# Altium project Stabilizer_Pounder.PrjPCB (part 1 of 5)
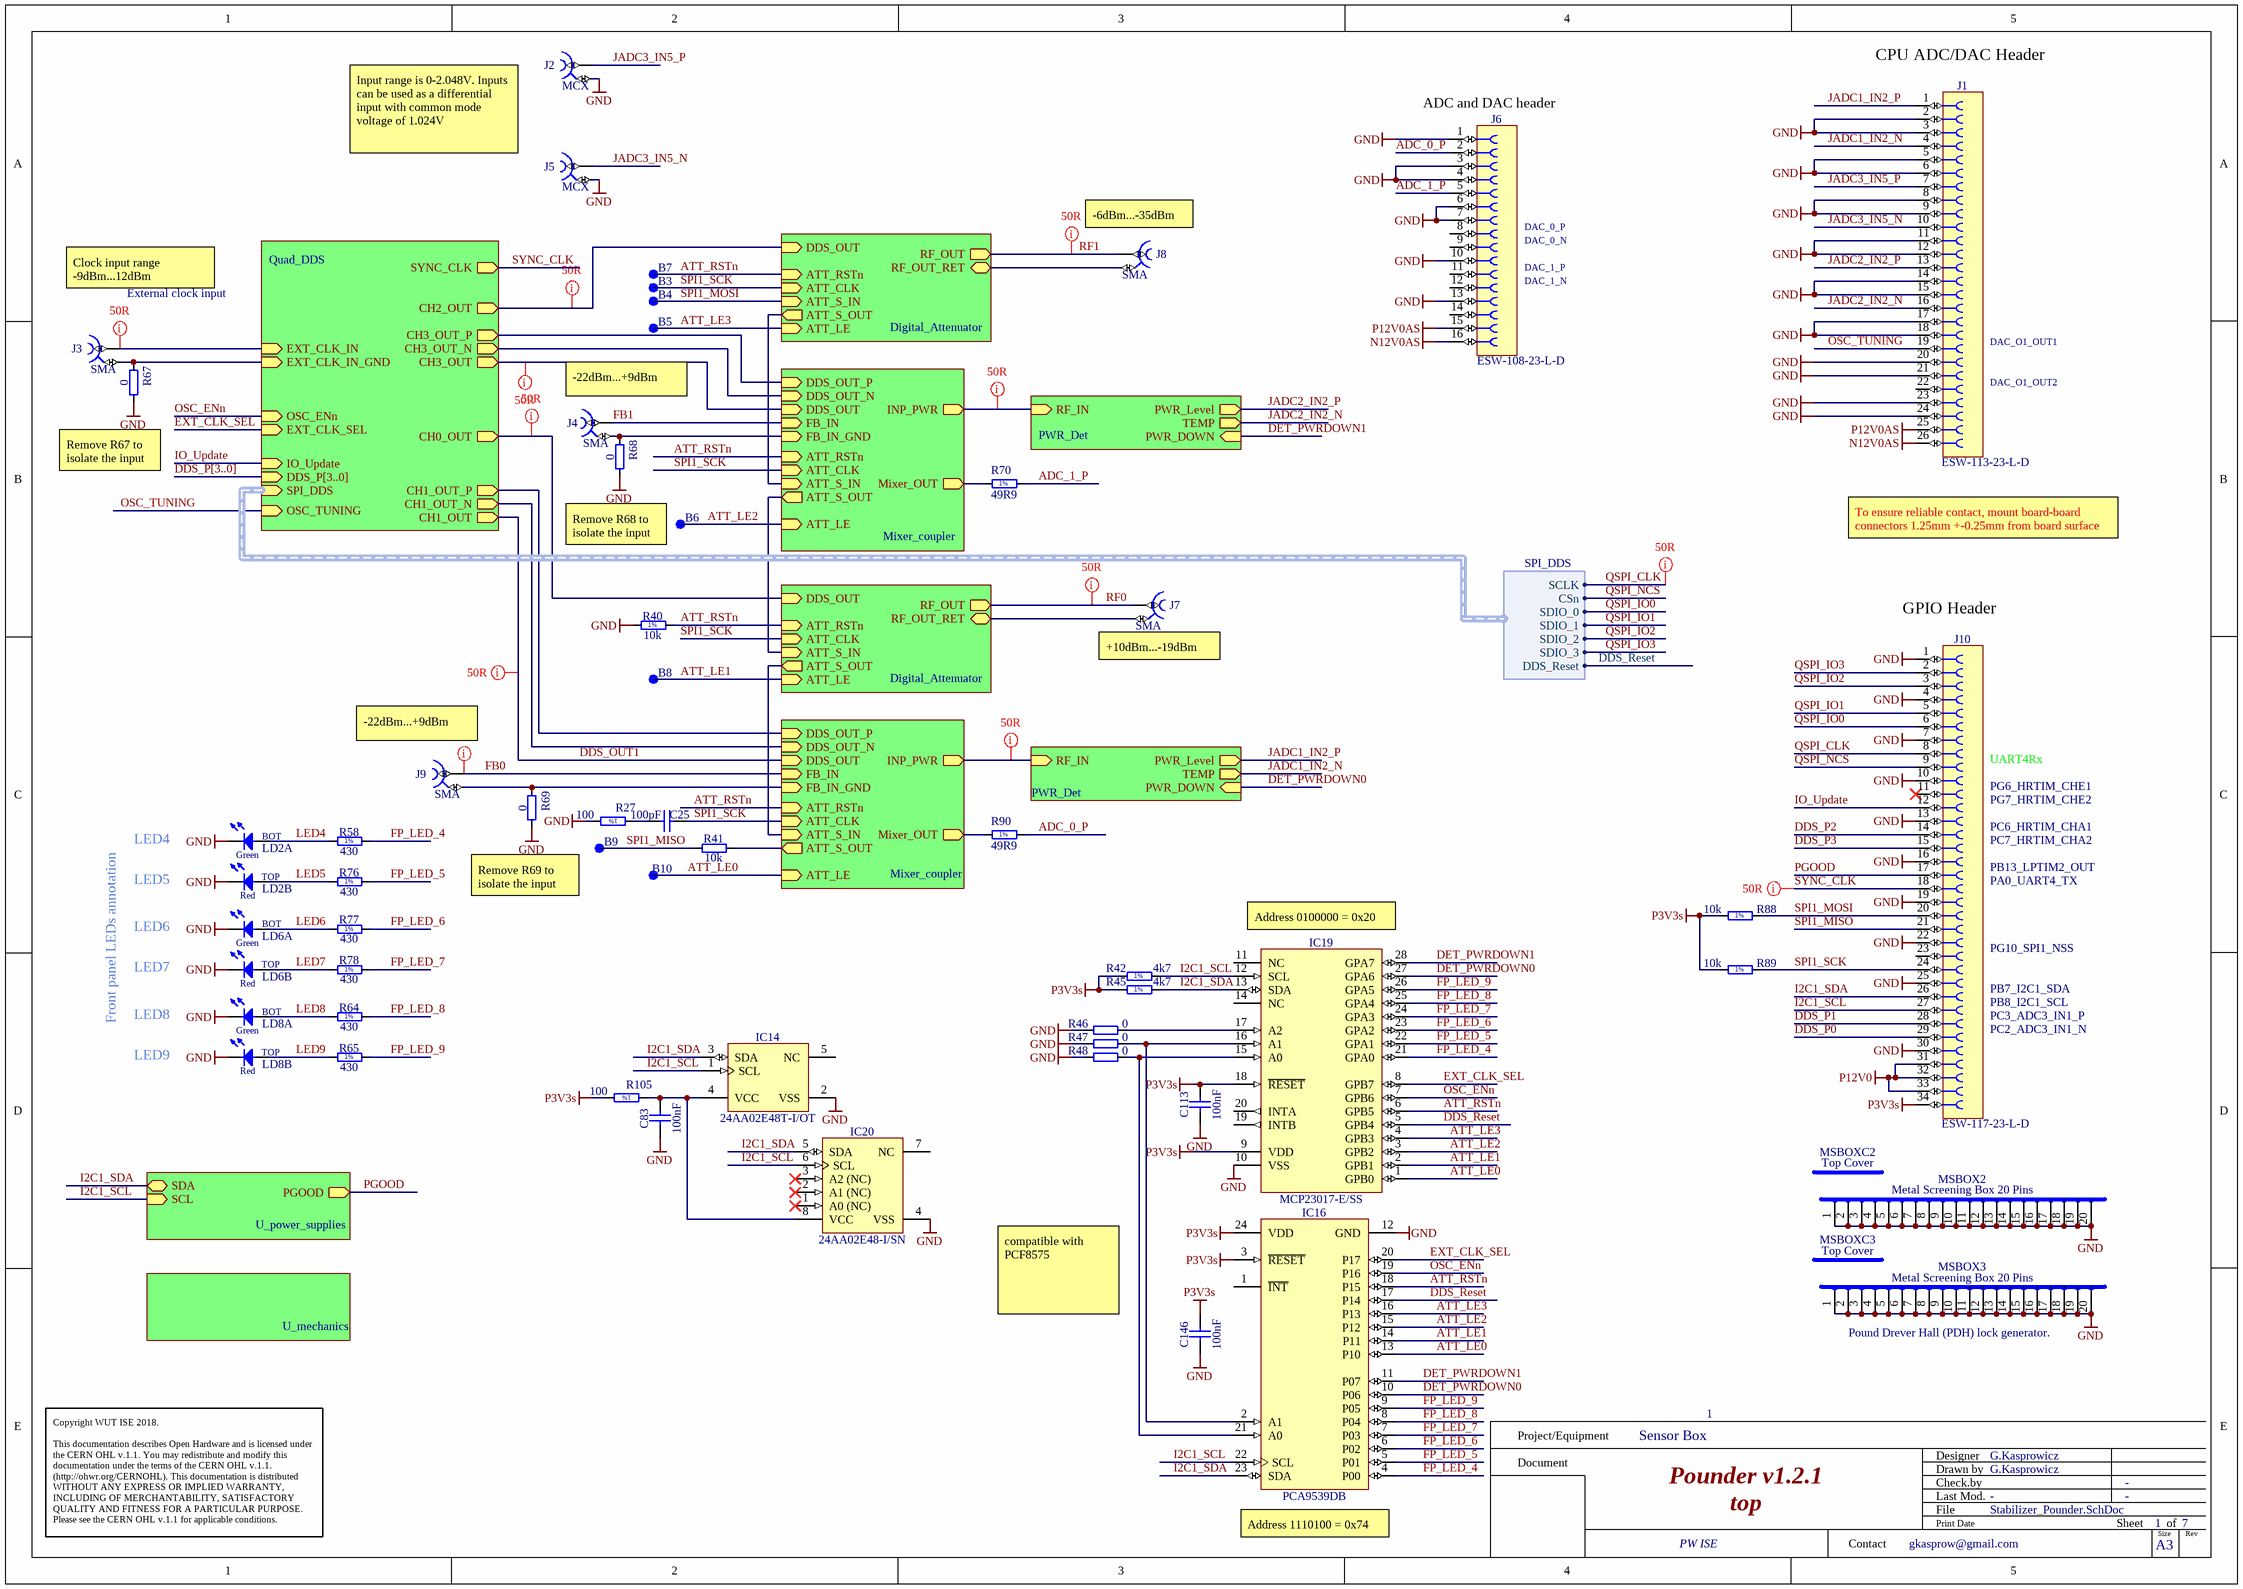
[diagram p0: Stabilizer_Pounder.SchDoc]
P_version: 1.2.1; ProjAddress1: WUT; ProjAddress3: PL; ProjOrganization: ISE; ProjRevision: 1.0
7 sheets, 591 parts. Net scope: hierarchical (ports join the sheet entries above them; power ports are global).
Board files: Stabilizer_Pounder.PcbDoc, Panel_Pounder.PcbDoc
Sheets:
  Stabilizer_Pounder.SchDoc
    U_power_supplies = power_supplies.SchDoc
    U_mechanics = mechanics.SchDoc
    Quad_DDS = Quad_DDS.SchDoc
    Digital_Attenuator = Digital_Attenuator.SchDoc
    PWR_Det = PWR_Det.SchDoc
    Mixer_coupler = Mixer_coupler.SchDoc
    Digital_Attenuator = Digital_Attenuator.SchDoc
    PWR_Det = PWR_Det.SchDoc
    Mixer_coupler = Mixer_coupler.SchDoc

## Sheet Stabilizer_Pounder.SchDoc: Pounder v1.2.1
size 420 x 297 mm; Author: G.Kasprowicz; CompanyName: WUT ISE; DrawnBy: G.Kasprowicz; Organization: WUT ISE; Address1: PW ISE; Address2: Nowowiejska 15/19 00-665 Warsaw; Address3: gkasprow@gmail.com; DocumentNumber: 1; Revision: 1.2.1; SheetNumber: 1; SheetTotal: 7; ModifiedBy: -; CheckedDate: -; Title2: top; DivGrp: WUT ISE; Designer: G.Kasprowicz; ModifiedDate: -; ProjectName: Sensor Box

### Parts
B3  SMD Pad  [C100]  (value not drawn)
B4  SMD Pad  [C100]  (value not drawn)
B5  SMD Pad  [C100]  (value not drawn)
B6  SMD Pad  [C100]  (value not drawn)
B7  SMD Pad  [C100]  (value not drawn)
B8  SMD Pad  [C100]  (value not drawn)
B9  SMD Pad  [C100]  (value not drawn)
B10  SMD Pad  [C100]  (value not drawn)
C25  100pF  [CAPC1005X55N]
C83  100nF  [CAPC1005X55N]
C113  100nF  [CAPC1005X55N]
C146  100nF  [CAPC1005X55N]
IC14  24AA02E48T-I/OT  [SOT95P280X145-5N]
IC16  PCA9539DB  [SOP65P780X200-24N]
IC19  MCP23017-E/SS  [SOP65P780X200-28N]
IC20  24AA02E48-I/SN  [SOIC127P600X175-8N]
J1  ESW-113-23-L-D  [ESW-113-23-L-D]
J2  MCX  [AMPHENOL_919-383J-51A]
J3  SMA  [DELOCK_65848]
J4  SMA  [DELOCK_65848]
J5  MCX  [AMPHENOL_919-383J-51A]
J6  ESW-108-23-L-D  [ESW-108-23-L-D]
J7  SMA  [DELOCK_65848]
J8  SMA  [DELOCK_65848]
J9  SMA  [DELOCK_65848]
J10  ESW-117-23-L-D  [ESW-117-23-L-D]
LD2  Red/Green  [LED_DIALIGHT_571-0112F]  (value not drawn)  (parts A,B of 2)
LD6  Red/Green  [LED_DIALIGHT_571-0112F]  (value not drawn)  (parts A,B of 2)
LD8  Red/Green  [LED_DIALIGHT_571-0112F]  (value not drawn)  (parts A,B of 2)
MSBOX2  Metal Screening Box 20 Pins  [MSBOX_LAIRD_BMI-S-205-F]
MSBOX3  Metal Screening Box 20 Pins  [MSBOX_LAIRD_BMI-S-205-F]
MSBOXC2  Top Cover  [MSBOX_LAIRD_BMI-S-205-C]
MSBOXC3  Top Cover  [MSBOX_LAIRD_BMI-S-205-C]
R27  100  [RESC1005X40N]
R40  10k  [RESC1005X40N]
R41  10k  [RESC1005X40N]
R42  4k7  [RESC1005X40N]
R45  4k7  [RESC1005X40N]
R46  0  [RESC1005X40N]
R47  0  [RESC1005X40N]
R48  0  [RESC1005X40N]
R58  430  [RESC1608X55N]
R64  430  [RESC1608X55N]
R65  430  [RESC1608X55N]
R67  0  [RESC1608X55N]
R68  0  [RESC1608X55N]
R69  0  [RESC1608X55N]
R70  49R9  [RESC1608X55N]
R76  430  [RESC1608X55N]
R77  430  [RESC1608X55N]
R78  430  [RESC1608X55N]
R88  10k  [RESC1005X40N]
R89  10k  [RESC1005X40N]
R90  49R9  [RESC1608X55N]
R105  100  [RESC1005X40N]

### Sub-sheets
Digital_Attenuator = Digital_Attenuator.SchDoc: RF_OUT (out), ATT_RSTn (in), ATT_CLK (in), ATT_S_OUT (out), ATT_S_IN (in), ATT_LE (in), DDS_OUT (in), RF_OUT_RET (bidir)
Digital_Attenuator = Digital_Attenuator.SchDoc: RF_OUT (out), ATT_RSTn (in), ATT_CLK (in), ATT_S_OUT (out), ATT_S_IN (in), ATT_LE (in), DDS_OUT (in), RF_OUT_RET (bidir)
Mixer_coupler = Mixer_coupler.SchDoc: INP_PWR (out), FB_IN (in), FB_IN_GND (in), DDS_OUT (in), Mixer_OUT (out), ATT_S_OUT (out), ATT_CLK (in), ATT_RSTn (in), ATT_S_IN (in), ATT_LE (in), DDS_OUT_P (in), DDS_OUT_N (in)
Mixer_coupler = Mixer_coupler.SchDoc: INP_PWR (out), FB_IN (in), FB_IN_GND (in), DDS_OUT (in), Mixer_OUT (out), ATT_S_OUT (out), ATT_CLK (in), ATT_LE (in), ATT_RSTn (in), ATT_S_IN (in), DDS_OUT_P (in), DDS_OUT_N (in)
PWR_Det = PWR_Det.SchDoc: RF_IN (in), PWR_Level (out), TEMP (out), PWR_DOWN (in)
PWR_Det = PWR_Det.SchDoc: RF_IN (in), PWR_Level (out), TEMP (out), PWR_DOWN (in)
Quad_DDS = Quad_DDS.SchDoc: CH3_OUT (out), CH1_OUT (out), OSC_ENn (in), CH0_OUT (out), EXT_CLK_SEL (in), EXT_CLK_IN (in), CH2_OUT (out), EXT_CLK_IN_GND (in), IO_Update (in), DDS_P[3..0] (in), SPI_DDS (in, harness SPI_DDS), OSC_TUNING (in), SYNC_CLK (out), CH1_OUT_P (out), CH3_OUT_N (out), CH3_OUT_P (out), CH1_OUT_N (out)
U_mechanics = mechanics.SchDoc: no entries
U_power_supplies = power_supplies.SchDoc: SDA (bidir), SCL (in), PGOOD (out)

### Harnesses
SPI_DDS: SCLK, CSn, SDIO_0, SDIO_1, SDIO_2, SDIO_3, DDS_Reset

### Nets
GND: C83.1 C113.1 C146.1 IC14.2(VSS) IC16.12(GND) IC19.10(VSS) IC20.4(VSS) J1.2 J1.3 J1.5 J1.6 J1.8 J1.9 J1.11 J1.12 J1.14 J1.15 J1.17 J1.18 J1.20 J1.21 J1.23 J1.24 J2.2 J5.2 J6.1 J6.3 J6.4 J6.6 J6.7 J6.10 J6.13 J10.1 J10.4 J10.7 J10.10 J10.13 J10.16 J10.19 J10.22 J10.25 J10.30 LD2.1(C) LD2.3(C) LD6.1(C) LD6.3(C) LD8.1(C) LD8.3(C) MSBOX2.1 MSBOX2.2 MSBOX2.3 MSBOX2.4 MSBOX2.5 MSBOX2.6 MSBOX2.7 MSBOX2.8 MSBOX2.9 MSBOX2.10 MSBOX2.11 MSBOX2.12 MSBOX2.13 MSBOX2.14 MSBOX2.15 MSBOX2.16 MSBOX2.17 MSBOX2.18 MSBOX2.19 MSBOX2.20 MSBOX3.1 MSBOX3.2 MSBOX3.3 MSBOX3.4 MSBOX3.5 MSBOX3.6 MSBOX3.7 MSBOX3.8 MSBOX3.9 MSBOX3.10 MSBOX3.11 MSBOX3.12 MSBOX3.13 MSBOX3.14 MSBOX3.15 MSBOX3.16 MSBOX3.17 MSBOX3.18 MSBOX3.19 MSBOX3.20 R27.2 R40.1 R46.1 R47.1 R48.1 R67.2 R68.2 R69.2
N12V0AS: J1.26 J6.16
P3V3s: C113.2 C146.2 IC16.3(~{RESET}) IC16.24(VDD) IC19.9(VDD) IC19.18(~{RESET}) J10.34 R42.1 R45.1 R88.1 R89.1 R105.2
P12V0: J10.31 J10.32 J10.33
P12V0AS: J1.25 J6.15
ADC_0_P: J6.2 R90.2
ADC_1_P: J6.5 R70.2
ATT_LE0: B10.1 IC16.13(P10) IC19.1(GPB0) ; sheet Mixer_coupler/ATT_LE  [project net ATT_LE]
ATT_LE1: B8.1 IC16.14(P11) IC19.2(GPB1) ; sheet Digital_Attenuator/ATT_LE
ATT_LE2: B6.1 IC16.15(P12) IC19.3(GPB2) ; sheet Mixer_coupler/ATT_LE  [project net ATT_LE]
ATT_LE3: B5.1 IC16.16(P13) IC19.4(GPB3) ; sheet Digital_Attenuator/ATT_LE
ATT_RSTn: B7.1 IC16.18(P15) IC19.6(GPB5) R40.2 ; sheet Digital_Attenuator/ATT_RSTn, sheet Mixer_coupler/ATT_RSTn, sheet Digital_Attenuator/ATT_RSTn, sheet Mixer_coupler/ATT_RSTn
CH1_OUTC_N: sheet Quad_DDS/CH1_OUT_N, sheet Mixer_coupler/DDS_OUT_N
CH1_OUTC_P: sheet Quad_DDS/CH1_OUT_P, sheet Mixer_coupler/DDS_OUT_P
CH3_OUTC_N: sheet Quad_DDS/CH3_OUT_N, sheet Mixer_coupler/DDS_OUT_N
CH3_OUTC_P: sheet Quad_DDS/CH3_OUT_P, sheet Mixer_coupler/DDS_OUT_P
DDS_OUT1: sheet Quad_DDS/CH1_OUT, sheet Mixer_coupler/DDS_OUT
DDS_P0: J10.29
DDS_P1: J10.28
DDS_P2: J10.14
DDS_P3: J10.15
DDS_Reset: IC16.17(P14) IC19.5(GPB4) ; sheet Quad_DDS/SPI_DDS.DDS_Reset
DET_PWRDOWN0: IC16.10(P06) IC19.27(GPA6) ; sheet PWR_Det/PWR_DOWN
DET_PWRDOWN1: IC16.11(P07) IC19.28(GPA7) ; sheet PWR_Det/PWR_DOWN
EXT_CLK_SEL: IC16.20(P17) IC19.8(GPB7) ; sheet Quad_DDS/EXT_CLK_SEL
FB0: J9.1 ; sheet Mixer_coupler/FB_IN
FB1: J4.1 ; sheet Mixer_coupler/FB_IN
FP_LED_4: IC16.4(P00) IC19.21(GPA0) R58.2
FP_LED_5: IC16.5(P01) IC19.22(GPA1) R76.2
FP_LED_6: IC16.6(P02) IC19.23(GPA2) R77.2
FP_LED_7: IC16.7(P03) IC19.24(GPA3) R78.2
FP_LED_8: IC16.8(P04) IC19.25(GPA4) R64.2
FP_LED_9: IC16.9(P05) IC19.26(GPA5) R65.2
I2C1_SCL: IC14.1(SCL) IC16.22(SCL) IC19.12(SCL) IC20.6(SCL) J10.27 R42.2 ; sheet U_power_supplies/SCL
I2C1_SDA: IC14.3(SDA) IC16.23(SDA) IC19.13(SDA) IC20.5(SDA) J10.26 R45.2 ; sheet U_power_supplies/SDA
IO_Update: J10.12 ; sheet Quad_DDS/IO_Update
JADC1_IN2_N: J1.4 ; sheet PWR_Det/TEMP
JADC1_IN2_P: J1.1 ; sheet PWR_Det/PWR_Level
JADC2_IN2_N: J1.16 ; sheet PWR_Det/TEMP
JADC2_IN2_P: J1.13 ; sheet PWR_Det/PWR_Level
JADC3_IN5_N: J1.10 J5.1
JADC3_IN5_P: J1.7 J2.1
LED4: LD2.2(A) R58.1
LED5: LD2.4(A) R76.1
LED6: LD6.2(A) R77.1
LED7: LD6.4(A) R78.1
LED8: LD8.2(A) R64.1
LED9: LD8.4(A) R65.1
OSC_ENn: IC16.19(P16) IC19.7(GPB6) ; sheet Quad_DDS/OSC_ENn
OSC_TUNING: J1.19 ; sheet Quad_DDS/OSC_TUNING
PGOOD: J10.17 ; sheet U_power_supplies/PGOOD
QSPI_CLK: J10.8 ; sheet Quad_DDS/SPI_DDS.SCLK
QSPI_IO0: J10.6 ; sheet Quad_DDS/SPI_DDS.SDIO_0
QSPI_IO1: J10.5 ; sheet Quad_DDS/SPI_DDS.SDIO_1
QSPI_IO2: J10.3 ; sheet Quad_DDS/SPI_DDS.SDIO_2
QSPI_IO3: J10.2 ; sheet Quad_DDS/SPI_DDS.SDIO_3
QSPI_NCS: J10.9 ; sheet Quad_DDS/SPI_DDS.CSn  [project net CSn]
RF0: J7.1 ; sheet Digital_Attenuator/RF_OUT
RF1: J8.1 ; sheet Digital_Attenuator/RF_OUT
SPI1_MISO: B9.1 J10.21 R41.1
SPI1_MOSI: B4.1 J10.20 R88.2 ; sheet Digital_Attenuator/ATT_S_IN
SPI1_SCK: B3.1 C25.2 J10.24 R89.2 ; sheet Digital_Attenuator/ATT_CLK, sheet Mixer_coupler/ATT_CLK, sheet Digital_Attenuator/ATT_CLK, sheet Mixer_coupler/ATT_CLK  [project net ATT_CLK]
SYNC_CLK: J10.18 ; sheet Quad_DDS/SYNC_CLK
NetC25_1: C25.1 R27.1
NetC26B_2: sheet Mixer_coupler/ATT_S_OUT, sheet Digital_Attenuator/ATT_S_IN
NetC83_2: C83.2 IC14.4(VCC) IC20.8(VCC) R105.1
NetC86A_2: sheet Digital_Attenuator/ATT_S_OUT, sheet Mixer_coupler/ATT_S_IN
NetC86B_2: sheet Digital_Attenuator/ATT_S_OUT, sheet Mixer_coupler/ATT_S_IN
NetC114A_1: sheet PWR_Det/RF_IN, sheet Mixer_coupler/INP_PWR
NetC114B_1: sheet PWR_Det/RF_IN, sheet Mixer_coupler/INP_PWR
NetC119A_2: R70.1 ; sheet Mixer_coupler/Mixer_OUT
NetC119B_2: R90.1 ; sheet Mixer_coupler/Mixer_OUT
NetFL2A_1: sheet Quad_DDS/CH2_OUT, sheet Digital_Attenuator/DDS_OUT
NetFL2B_1: sheet Quad_DDS/CH0_OUT, sheet Digital_Attenuator/DDS_OUT
NetFL3A_2: J4.2 R68.1 ; sheet Mixer_coupler/FB_IN_GND
NetFL3B_2: J9.2 R69.1 ; sheet Mixer_coupler/FB_IN_GND
NetFL4A_1: sheet Quad_DDS/CH3_OUT, sheet Mixer_coupler/DDS_OUT
NetIC8B_19: R41.2 ; sheet Mixer_coupler/ATT_S_OUT
NetIC16_2: IC16.2(A1) IC19.16(A1) R47.2
NetIC16_21: IC16.21(A0) IC19.15(A0) R48.2
NetIC19_17: IC19.17(A2) R46.2
NetJ3_1: J3.1 ; sheet Quad_DDS/EXT_CLK_IN
NetJ3_2: J3.2 R67.1 ; sheet Quad_DDS/EXT_CLK_IN_GND
NetJ7_2: J7.2 ; sheet Digital_Attenuator/RF_OUT_RET
NetJ8_2: J8.2 ; sheet Digital_Attenuator/RF_OUT_RET

Not connected (* = marked no-connect by the designer): IC14 5(NC); IC16 1(~{INT}); IC19 11(NC) 14(NC) 19(INTB) 20(INTA); IC20 1(A0_(NC))* 2(A1_(NC))* 3(A2_(NC))* 7(NC); J1 22; J6 8 9 11 12 14; J10 11* 23

### Buses and harness runs
bus DDS_P[3..0] = sheet Quad_DDS/DDS_P[3..0]

### Layout directives
net class Z50R: DDS_OUT1, FB0, NetC114A_1, NetC114B_1, NetFL2A_1, NetFL2B_1, NetFL4A_1, NetJ3_1, QSPI_CLK, RF0, RF1, SYNC_CLK

### Notes on the sheet
- (near J6) ADC and DAC header
- (near J1) CPU ADC/DAC Header
- Input range is 0-2.048V. Inputs can be used as a differential input with common mode voltage of 1.024V
- (near J8) -6dBm...-35dBm
- (near J6) DAC_0_P
- (near J6) DAC_0_N
- Clock input range
  -9dBm...12dBm
- External clock input
- (near J6) DAC_1_P
- (near J6) DAC_1_N
- -22dBm...+9dBm
- (near J1) DAC_O1_OUT1
- (near J1) DAC_O1_OUT2
- (near R67) Remove R67 to isolate the input
- To ensure reliable contact, mount board-board connectors 1.25mm +-0.25mm from board surface
- (near B6) Remove R68 to isolate the input
- (near J7) +10dBm...-19dBm
- (near J10) GPIO Header
- (near J9) -22dBm...+9dBm
- (near J10) UART4Rx
- (near J10) PG6_HRTIM_CHE1
- (near J10) PG7_HRTIM_CHE2
- LED4
- (near J10) PC6_HRTIM_CHA1
- (near J10) PC7_HRTIM_CHA2
- LED5
- LED6
- Remove R69 to isolate the input
- (near IC19) Address 0100000 = 0x20
- (near J10) PB13_LPTIM2_OUT
- (near J10) PA0_UART4_TX
- LED7
- (near J10) PB7_I2C1_SDA
- (near J10) PG10_SPI1_NSS
- Front panel LEDs annotation
- LED8
- LED9
- (near J10) PC3_ADC3_IN1_P
- (near J10) PC2_ADC3_IN1_N
- (near J10) PB8_I2C1_SCL
- compatible with
  PCF8575
- (near MSBOX3) Pound Drever Hall (PDH) lock generator.
- (near IC16) Address 1110100 = 0x74
- Project/Equipment
- Document
- Designer
- Drawn by
- Check.by
- Copyright WUT ISE 2018.
  This documentation describes Open Hardware and is licensed under the CERN OHL v.1.1. You may redistribute and modify this documentation under the terms of the CERN OHL v.1.1. (http://ohwr.org/CERNOHL). This documentation is distributed WITHOUT ANY EXPRESS OR IMPLIED WARRANTY, INCLUDING OF MERCHANTABILITY, SATISFACTORY QUALITY AND FITNESS FOR A PARTICULAR PURPOSE. Please see the CERN OHL v.1.1 for applicable conditions.
- Contact
- File
- Last Mod.
- Print Date
- Sheet
- Size
- A3
- of
- Rev
- (in symbol LED_DIALIGHT_571-0112F, part A) BOT; Green
- (in symbol LED_DIALIGHT_571-0112F, part B) TOP; Red
- (in symbol R0402_4K7_1%_0.0625W_100PPM) 1%
- (in symbol R0402_10k_1%_0.0625W_100PPM) 1%
- (in symbol R0402_10K_1%_0.0625W_100PPM) 1%
- (in symbol R0402_100R_1%_0.0625W_100PPM) 1%
- (in symbol R0603_49R9_1%_0.1W_100PPM) 1%
- (in symbol R0603_430R_1%_0.1W_100PPM) 1%

### Library data of the parts
B3-B10 = SMD_PAD_D1MM: Through Hole Pad; Part Description: 1mm Diameter SMD Pad; Mounted: No; Part Number: SMD_PAD_D1MM; Component Kind: Standard (No BOM); Component Type: Standard (No BOM); Pin Count: 1; Family: SMD Pad; Socket: No; SMD: No; Sense: No; Status: None; ComponentHeight: 0mm; HelpURL: Undefined; Author: CERN DEM JLC; CreateDate: 10.10.2017; LatestRevisionDate: 10.10.2017; PackageDescription: 1mm Diameter SMD Pad
C25 = CC0402_100PF_50V_5%_C0G: Non-polarised capacitor; Part Description: SMD Multilayer Chip Ceramic Capacitor; Manufacturer: GENERIC; Manufacturer1 Part Number: C0402C101J5GACTU; Voltage: 50V; TC: C0G/NP0; Tolerance: ±5%; Part Number: CC0402_100PF_50V_5%_C0G; Component Kind: Standard; Component Type: Standard; Pin Count: 2; Value: 100pF; Status: Preferred; Manufacturer Part Number: CC0402_100PF_50V_5%_C0G; Case: 0402; Mounted: Yes; Socket: No; SMD: Yes; Sense: No; Manufacturer1 Example: KEMET; Manufacturer1 ComponentHeight: 0.55mm; HelpURL: \\cern.ch\dfs\Applications\Altium\Datasheets\CC0805_C0G_KEMET_(Commercial Grade).pdf; Author: CERN DEM JLC; CreateDate: 03.12.2007; LatestRevisionDate: 22.04.2015
C83 C113 C146 = CC0402_100NF_16V_10%_X5R: Non-polarised capacitor; Part Description: SMD Multilayer Chip Ceramic Capacitor; Manufacturer: GENERIC; Manufacturer1 Part Number: GRM155R61C104KA88D; Voltage: 16V; TC: X5R; Tolerance: ±10%; Part Number: CC0402_100NF_16V_10%_X5R; Component Kind: Standard; Component Type: Standard; Pin Count: 2; Value: 100nF; Status: None; Manufacturer Part Number: CC0402_100NF_16V_10%_X5R; Case: 0402; Mounted: Yes; Socket: No; SMD: Yes; Sense: No; Manufacturer1 Example: MURATA; Manufacturer1 ComponentHeight: 0.55mm; HelpURL: \\cern.ch\dfs\Applications\Altium\Datasheets\CC0402_X5R_MURATA_GRM.pdf; Author: CERN DEM JLC; CreateDate: 10.12.2013; LatestRevisionDate: 10.12.2013
IC14 = 24AA02E48T-I/OT: 1.7V-5.5V, 2K I2C Serial EEPROM With EUI-48 Node Identity; Manufacturer: MICROCHIP TECHNOLOGY; PressFit: No; Bonding: No; Part Number: 24AA02E48T-I/OT; Component Kind: Standard; Component Type: Standard; Device: 24AA02E48T-I/OT; PackageDescription: SOT, 0.95mm pitch; 5 pin, 1.60mm W X 2.90mm L X 1.45mm H body, IPC Medium Density; Part Description: 1.7V-5.5V, 2K I2C Serial EEPROM With EUI-48 Node Identity; Manufacturer Part Number: 24AA02E48T-I/OT; Pin Count: 5; Case: SOT23-5; Mounted: Yes; Socket: No; SMD: Yes; Sense: No; ComponentHeight: 1.45mm; HelpURL: \\cern.ch\dfs\Applications\Altium\Datasheets\24AA02E48T-I-OT.pdf; Author: CERN DEM MR; CreateDate: 31.03.2016; LatestRevisionDate: 31.03.2016
IC16 = PCA9539DB: Remote 16-Bit I2C and SMBus Low-Power I/O Expander With Interrupt Output, Reset, and Configuration Registers; Manufacturer: TEXAS INSTRUMENTS; PressFit: No; Bonding: No; Part Number: PCA9539DB; Component Kind: Standard; Component Type: Standard; Device: PCA9539DB; PackageDescription: SOP, 0.65mm Pitch; 24 pin, 5.30mm W X 8.20mm L X 2.00mm H body, IPC Medium Density; Part Description: Remote 16-Bit I2C and SMBus Low-Power I/O Expander With Interrupt Output, Reset, and Configuration Registers; Manufacturer Part Number: PCA9539DB; Pin Count: 24; Case: TSSOP24; Mounted: Yes; Socket: No; SMD: Yes; Sense: No; ComponentHeight: 2mm; Author: CERN DEM HF; HelpURL: \\cern.ch\dfs\Applications\Altium\Datasheets\PCA9539DB.pdf; CreateDate: 09.06.2022; LatestRevisionDate: 09.06.2022
IC19 = MCP23017-E/SS: 16-bit I/O Port Expander With Serial Interface; Manufacturer: MICROCHIP TECHNOLOGY; PressFit: No; Bonding: No; Part Number: MCP23017-E/SS; Component Kind: Standard; Component Type: Standard; Device: MCP23017-E/SS; PackageDescription: SOP, 0.65mm Pitch; 28 pin, 5.30mm W X 10.20mm L X 2.00mm H body, IPC Medium Density; Part Description: 16-bit I/O Port Expander With Serial Interface; Manufacturer Part Number: MCP23017-E/SS; Pin Count: 28; Case: SSOP28; Mounted: Yes; Socket: No; SMD: Yes; Sense: No; ComponentHeight: 2mm; Author: CERN DEM JLC; HelpURL: \\cern.ch\dfs\Applications\Altium\Datasheets\MCP23017-E-SS.pdf; CreateDate: 17.01.2011; LatestRevisionDate: 17.01.2011
IC20 = MEM_24AA02E48-I/SN: 1.7V-5.5V, 2K I2C™ Serial EEPROMs with EUI-48™ Node Identity; Manufacturer: MICROCHIP TECHNOLOGY; PressFit: No; Bonding: No; Part Number: 24AA02E48-I/SN; Component Kind: Standard; Component Type: Standard; Device: 24AA02E48-I/SN; PackageDescription: SOIC, 1.27mm Pitch; 8 Pin - Body 4x5mm, IPC Medium Density; Part Description: 1.7V-5.5V, 2K I2C™ Serial EEPROMs with EUI-48™ Node Identity; Manufacturer Part Number: 24AA02E48-I/SN; Pin Count: 8; Case: SOIC8; Mounted: Yes; Socket: No; SMD: Yes; Sense: No; ComponentHeight: 1.75mm; HelpURL: \\cern.ch\dfs\Applications\Altium\Datasheets\24AA025E48-I-SN.pdf; Author: CERN DEM MR; CreateDate: 19.07.2016; LatestRevisionDate: 19.07.2016
J1 = ESW-113-23-L-D: Connector Elevated Socket 26 POS 2.54mm, 13.59mm height; Manufacturer: Samtec; Manufacturer Part Number: ESW-113-23-L-D
J2 J5 = AMPHENOL_919-383J-51A: Part Description: 50 Ohm, RF Connector, MCX Right Angle PCB Receptacle Jack; PressFit: No; Part Number: AMPHENOL_919-383J-51A; Component Kind: Standard; Component Type: Standard; Pin Count: 5; Family: MCX; Mounted: Yes; Socket: No; SMD: No; Sense: No; Status: None; Manufacturer: AMPHENOL; Manufacturer Part Number: 919-383J-51A; ComponentHeight: 6mm; HelpURL: \\cern.ch\dfs\Applications\Altium\Datasheets\AMPHENOL_919-383J-51A.pdf; Author: CERN DEM BC; CreateDate: 31.01.2019; LatestRevisionDate: 31.01.2019
J3 J4 J7-J9 = CON_SMA_DELOCK_65848: 50 Ohm Through Hole SMA Right Angle PCB Jack; Manufacturer: DELOCK; Manufacturer Part Number: 5848 (4043619658480); PressFit: No; Part Number: DELOCK_65848; Component Kind: Standard; Component Type: Standard; Pin Count: 5; Family: SMA; Mounted: Yes; Socket: No; SMD: No; Sense: No; Status: None; Part Description: 50 Ohm Through Hole SMA Right Angle PCB Jack; ComponentHeight: 12.5; HelpURL: \\cern.ch\dfs\Applications\Altium\Datasheets\AMPHENOL_132203-16.pdf; Author: GK; CreateDate: 13.05.2019; LatestRevisionDate: 13.05.2019
J6 = ESW-108-23-L-D: Connector Elevated Socket 16 POS 2.54mm, 13.59mm height; Manufacturer: Samtec; Manufacturer Part Number: ESW-108-23-L-D
J10 = ESW-117-23-L-D: Connector Elevated Socket 34 POS 2.54mm, 13.59mm height; Manufacturer: Samtec; Manufacturer Part Number: ESW-117-23-L-D
LD2 LD6 LD8 = LED_DIALIGHT_571-0112F: 2x LED  Botom Green, Top Red; Part Description: Dual 2mm  LEDs, Red Top,Green Bot, CBI® Circuit Board Indicator (Without positioning pins); PressFit: No; Bonding: No; Part Number: LED_DIALIGHT_571-0112F; Component Kind: Standard; Component Type: Standard; Color: Red/Green; PackageDescription: 2x 2mm LED (Top: Red, Bot: Green) PCB Edge Mounting (Without positioning pins) DIALIGHT 571 Serie; Manufacturer: DIALIGHT; Manufacturer Part Number: 571-0112F; Pin Count: 4; Mounted: Yes; Socket: No; SMD: No; Sense: No; ComponentHeight: 8.6mm; HelpURL: \\cern.ch\dfs\Applications\Altium\Datasheets\LED_DIALIGHT_571-0112F.pdf; Author: CERN DEM JLC; CreateDate: 09.11.2009; LatestRevisionDate: 17.03.2010
MSBOX2 MSBOX3 = MSBOX_LAIRD_BMI-S-205-F: Part Description: Frame of Standard Surface Mount Shield (Two Piece), External Dimensions 25.4 x 38.1mm; Manufacturer: LAIRD; PressFit: No; Part Number: MSBOX_LAIRD_BMI-S-205-F; Component Kind: Standard; Component Type: Standard; Pin Count: 20; PackageDescription: Frame of Standard Surface Mount Shield (Two Piece), External Dimensions 25.4 x 38.1mm; Mounted: Yes; Socket: No; SMD: Yes; Sense: No; Status: None; Manufacturer Part Number: BMI-S-205-F; ComponentHeight: 6mm; HelpURL: \\cern.ch\dfs\Applications\Altium\Datasheets\MSBOX_LAIRD_BMI-S-205-F.pdf; Author: CERN DEM JLC; CreateDate: 21.06.2017; LatestRevisionDate: 21.06.2017
MSBOXC2 MSBOXC3 = MSBOX_LAIRD_BMI-S-205-C: Metal Screening Box - Top Cover 0 Pin; Part Description: Cover for Frame of Standard Surface Mount Shield (Two Piece), External Dimensions 25.86 x 38.56mm; Manufacturer: LAIRD; PressFit: No; Part Number: MSBOX_LAIRD_BMI-S-205-C; Component Kind: Standard; Component Type: Standard; Pin Count: 0; PackageDescription: Cover for Frame of Standard Surface Mount Shield (Two Piece), External Dimensions 25.86 x 38.56mm; Mounted: Yes; Socket: No; SMD: Yes; Sense: No; Status: None; Manufacturer Part Number: BMI-S-205-C; ComponentHeight: 2mm; HelpURL: \\cern.ch\dfs\Applications\Altium\Datasheets\MSBOX_LAIRD_BMI-S-205-C.pdf; Author: CERN DEM JLC; CreateDate: 21.06.2017; LatestRevisionDate: 21.06.2017
R27 R105 = R0402_100R_1%_0.0625W_100PPM: Resistor - 1%; Part Description: General Purpose Thick Film Chip Resistor; Manufacturer: GENERIC; Manufacturer1 Part Number: 232270671001L; TC: ±100ppm/°C; PressFit: No; Part Number: R0402_100R_1%_0.0625W_100PPM; Component Kind: Standard; Component Type: Standard; Pin Count: 2; Value: 100; Status: Not Recommended; Power: 0.0625W; Tolerance: ±1%; Manufacturer Part Number: R0402_100R_1%_0.0625W_100PPM; Case: 0402; Mounted: Yes; Sense: No; Socket: No; SMD: Yes; Manufacturer1 Example: YAGEO PHYCOMP; Manufacturer1 ComponentHeight: 0.4mm; HelpURL: \\cern.ch\dfs\Applications\Altium\Datasheets\R0402_Phycomp_RC0402.pdf; Author: CERN DEM JLC; CreateDate: 03.12.2007; LatestRevisionDate: 17.10.2012
R40 = R0402_10k_1%_0.0625W_100PPM: Resistor - 1%; Part Description: General Purpose Thick Film Chip Resistor; Manufacturer: GENERIC; Manufacturer1 Part Number: 232270671003L; TC: ±100ppm/°C; PressFit: No; Part Number: R0402_10K_1%_0.0625W_100PPM; Component Kind: Standard; Component Type: Standard; Pin Count: 2; Value: 10k; Status: Not Recommended; Power: 0.0625W; Tolerance: ±1%; Manufacturer Part Number: R0402_10K_1%_0.0625W_100PPM; Case: 0402; Mounted: Yes; Sense: No; Socket: No; SMD: Yes; Manufacturer1 Example: YAGEO PHYCOMP; Manufacturer1 ComponentHeight: 0.4mm; HelpURL: \\cern.ch\dfs\Applications\Altium\Datasheets\R0402_Phycomp_RC0402.pdf; Author: CERN DEM JLC; CreateDate: 03.12.2007; LatestRevisionDate: 17.10.2012
R41 R88 R89 = R0402_10K_1%_0.0625W_100PPM: Resistor - 1%; Part Description: General Purpose Thick Film Chip Resistor; Manufacturer: GENERIC; Manufacturer1 Part Number: 232270671003L; TC: ±100ppm/°C; PressFit: No; Part Number: R0402_10K_1%_0.0625W_100PPM; Component Kind: Standard; Component Type: Standard; Pin Count: 2; Value: 10k; Status: Not Recommended; Power: 0.0625W; Tolerance: ±1%; Manufacturer Part Number: R0402_10K_1%_0.0625W_100PPM; Case: 0402; Mounted: Yes; Sense: No; Socket: No; SMD: Yes; Manufacturer1 Example: YAGEO PHYCOMP; Manufacturer1 ComponentHeight: 0.4mm; HelpURL: \\cern.ch\dfs\Applications\Altium\Datasheets\R0402_Phycomp_RC0402.pdf; Author: CERN DEM JLC; CreateDate: 03.12.2007; LatestRevisionDate: 17.10.2012
R42 R45 = R0402_4K7_1%_0.0625W_100PPM: Resistor - 1%; Part Description: General Purpose Thick Film Chip Resistor; Manufacturer: GENERIC; Manufacturer1 Part Number: 232270674702L; TC: ±100ppm/°C; Part Number: R0402_4K7_1%_0.0625W_100PPM; Component Kind: Standard; Component Type: Standard; Pin Count: 2; Value: 4k7; Status: Not recommended; Power: 0.0625W; Tolerance: ±1%; Manufacturer Part Number: R0402_4K7_1%_0.0625W_100PPM; Case: 0402; Mounted: Yes; Sense: No; Socket: No; SMD: Yes; Manufacturer1 Example: YAGEO PHYCOMP; Manufacturer1 ComponentHeight: 0.4mm; HelpURL: \\cern.ch\dfs\Applications\Altium\Datasheets\R0402_Phycomp_RC0402.pdf; Author: CERN DEM JLC; CreateDate: 2007-12-03; LatestRevisionDate: 2012-10-17
R46-R48 = R0402_0R_JUMPER: Resistor; Part Description: 1A (0.05R Max DC Resistance) Zero Ohm Jumper; Manufacturer: GENERIC; Manufacturer1 Part Number: 232270591001L; Part Number: R0402_0R_JUMPER; Component Kind: Standard; Component Type: Standard; Pin Count: 2; Value: 0; Status: Not recommended; Manufacturer Part Number: R0402_0R_JUMPER; Case: 0402; Mounted: Yes; Sense: No; Socket: No; SMD: Yes; Manufacturer1 Example: YAGEO PHYCOMP; Manufacturer1 ComponentHeight: 0.4mm; HelpURL: \\cern.ch\dfs\Applications\Altium\Datasheets\R0402_Phycomp_RC0402.pdf; Author: CERN DEM JLC; CreateDate: 2007-12-03; LatestRevisionDate: 2012-10-17
R58 R64 R65 R76-R78 = R0603_430R_1%_0.1W_100PPM: Resistor - 1%; Part Description: General Purpose Thick Film Chip Resistor; Manufacturer: GENERIC; Manufacturer1 Part Number: NRC06F4300TRF; Power: 0.1W; TC: ±100ppm/°C; PressFit: No; Part Number: R0603_430R_1%_0.1W_100PPM; Component Kind: Standard; Component Type: Standard; Pin Count: 2; Value: 430; Status: Preferred; Tolerance: ±1%; Manufacturer Part Number: R0603_430R_1%_0.1W_100PPM; Case: 0603; Mounted: Yes; Sense: No; Socket: No; SMD: Yes; Manufacturer1 Example: NIC COMPONENT; Manufacturer1 ComponentHeight: 0.55mm; HelpURL: \\cern.ch\dfs\Applications\Altium\Datasheets\R0603_NIC_NRC.pdf; Author: CERN DEM JLC; CreateDate: 03.12.2007; LatestRevisionDate: 13.03.2008
R67-R69 = R0603_0R_JUMPER: Resistor; Part Description: 1A (0.05R Max DC Resistance) Zero Ohm Jumper; Manufacturer: GENERIC; Manufacturer1 Part Number: NRC06Z0; PressFit: No; Part Number: R0603_0R_JUMPER; Component Kind: Standard; Component Type: Standard; Pin Count: 2; Value: 0; Status: Preferred; Manufacturer Part Number: R0603_0R_JUMPER; Case: 0603; Mounted: Yes; Sense: No; Socket: No; SMD: Yes; Manufacturer1 Example: NIC COMPONENT; Manufacturer1 ComponentHeight: 0.55mm; HelpURL: \\cern.ch\dfs\Applications\Altium\Datasheets\R0603_NIC_NRC.pdf; Author: CERN DEM JLC; CreateDate: 03/12/2007; LatestRevisionDate: 13/03/2008
R70 R90 = R0603_49R9_1%_0.1W_100PPM: Resistor - 1%; Part Description: General Purpose Thick Film Chip Resistor; Manufacturer: GENERIC; Manufacturer1 Part Number: RC0603FR-0749R9L; Power: 0.1W; TC: ±100ppm/°C; PressFit: No; Part Number: R0603_49R9_1%_0.1W_100PPM; Component Kind: Standard; Component Type: Standard; Pin Count: 2; Value: 49R9; Status: Preferred; Tolerance: ±1%; Manufacturer Part Number: R0603_49R9_1%_0.1W_100PPM; Case: 0603; Mounted: Yes; Sense: No; Socket: No; SMD: Yes; Manufacturer1 Example: YAGEO PHYCOMP; Manufacturer1 ComponentHeight: 0.55mm; HelpURL: \\cern.ch\dfs\Applications\Altium\Datasheets\R0603_PHYCOMP_RC0603.pdf; Author: CERN DEM JLC; CreateDate: 21.11.2017; LatestRevisionDate: 21.11.2017